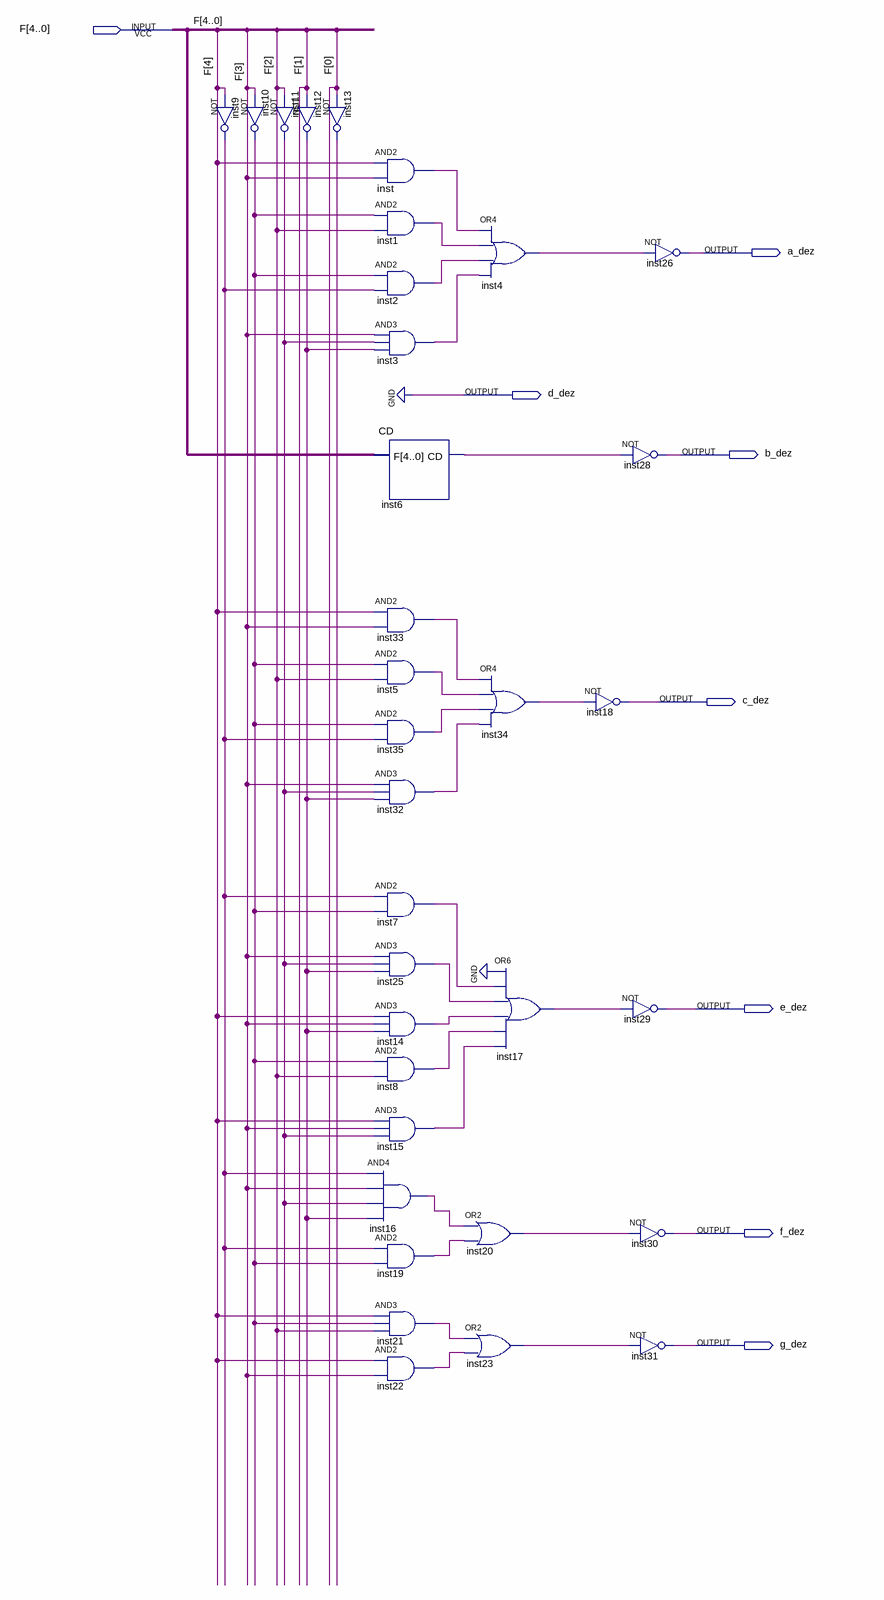
[diagram p0: schematic sheet]
// Quartus schematic Display_Dezenas.bdf as structural Verilog: 34 symbols, 8 pins
module Display_Dezenas (
  input  [4:0] F,
  output a_dez,
  output d_dez,
  output b_dez,
  output c_dez,
  output e_dez,
  output f_dez,
  output g_dez
);

  wire inst1_out, inst2_out, inst3_out, inst4_out, inst5_out, inst6_cd, inst7_out, inst8_out, inst9_out,
       inst10_out, inst11_out, inst12_out, inst13_out, inst14_out, inst15_out, inst16_out, inst17_out,
       inst19_out, inst20_out, inst21_out, inst22_out, inst23_out, inst25_out, inst32_out, inst33_out,
       inst34_out, inst35_out, inst_out;

  not inst9 (inst9_out, F[4]);
  not inst10 (inst10_out, F[3]);
  not inst11 (inst11_out, F[2]);
  not inst12 (inst12_out, F[1]);
  not inst13 (inst13_out, F[0]);
  and inst16 (inst16_out, inst9_out, F[3], inst11_out, inst12_out);
  and inst (inst_out, F[4], F[3]);
  and inst1 (inst1_out, inst10_out, F[2]);
  and inst2 (inst2_out, inst10_out, inst9_out);
  and inst3 (inst3_out, F[3], inst11_out, inst12_out);
  CD inst6 (.F(F), .CD(inst6_cd));
  and inst33 (inst33_out, F[4], F[3]);
  and inst5 (inst5_out, inst10_out, F[2]);
  and inst35 (inst35_out, inst10_out, inst9_out);
  and inst32 (inst32_out, F[3], inst11_out, inst12_out);
  and inst7 (inst7_out, inst9_out, inst10_out);
  and inst25 (inst25_out, F[3], inst11_out, inst12_out);
  and inst14 (inst14_out, F[4], F[3], inst12_out);
  and inst8 (inst8_out, inst10_out, F[2]);
  and inst15 (inst15_out, F[4], F[3], inst11_out);
  and inst19 (inst19_out, inst9_out, inst10_out);
  and inst21 (inst21_out, F[4], inst10_out, F[2]);
  and inst22 (inst22_out, F[4], F[3]);
  or inst4 (inst4_out, inst_out, inst1_out, inst2_out, inst3_out);
  or inst34 (inst34_out, inst33_out, inst5_out, inst35_out, inst32_out);
  or inst20 (inst20_out, inst16_out, inst19_out);
  or inst23 (inst23_out, inst21_out, inst22_out);
  or inst17 (inst17_out, 1'b0, inst7_out, inst25_out, inst14_out, inst8_out, inst15_out);
  not inst18 (c_dez, inst34_out);
  not inst26 (a_dez, inst4_out);
  not inst28 (b_dez, inst6_cd);
  not inst29 (e_dez, inst17_out);
  not inst30 (f_dez, inst20_out);
  not inst31 (g_dez, inst23_out);

  assign d_dez = 1'b0;
endmodule
